# Altium schematic sheet TempSensor.SchDoc
size A; SheetNumber: 3; SheetTotal: 4
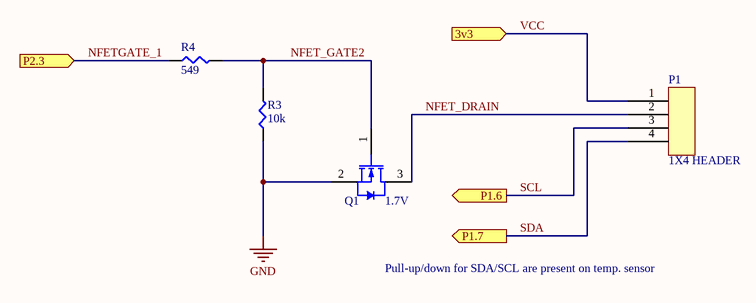
[diagram p0: TempSensor.SchDoc]

## Parts
P1  1X4 HEADER  [1X4 HEADER]
Q1  1.7V  [FAIR-SOT3-3_V]
R3  10k  [SMD-0805-RES]
R4  549  [SMD-0805-RES]

## Ports
3v3 (in), P1.6 (out), P1.7 (out), P2.3 (in)

## Nets
GND: Q1.2(S) R3.1
NFET_DRAIN: P1.2 Q1.3(D)
NFET_GATE2: Q1.1(G) R3.2 R4.2
NFETGATE_1: R4.1 ; port P2.3
SCL: P1.3 ; port P1.6
SDA: P1.4 ; port P1.7
VCC: P1.1 ; port 3v3

## Notes on the sheet
- Pull-up/down for SDA/SCL are present on temp. sensor

## Library data of the parts
P1 = 1X4 HEADER: CONN HEADER VERT 4POS 2.54MM; Manufacturer: Würth Elektronik; Manufacturer Part Number: 61300411121; Value: 1x4 Header
Q1 = CMP-2000-04934-1: N-Channel Logic Level Enhancement Mode Field Effect Transistor, 1.7V, -55 to 150 degC, 3-Pin SOT-23, RoHS, Tape and Reel; Manufacturer: Fairchild; Manufacturer Part Number: BSS123; Value: 1.7 V
R3 = ERJ-6ENF1002V: RES SMD 10k OHM 1% 1/8W 0805; Manufacturer: Panasonic Electronic Components; Manufacturer Part Number: ERJ-P06F1002V; Value: 10k
R4 = ERJ-6ENF5490V: RES SMD 549 OHM 1% 1/8W 0805; Manufacturer: Panasonic Electronic Components; Value: 549; Manufacturer Part Number: ERJ-6ENF5490V